# Altium schematic sheet AVR Board 4.0 Power Supply.SchDoc
size A
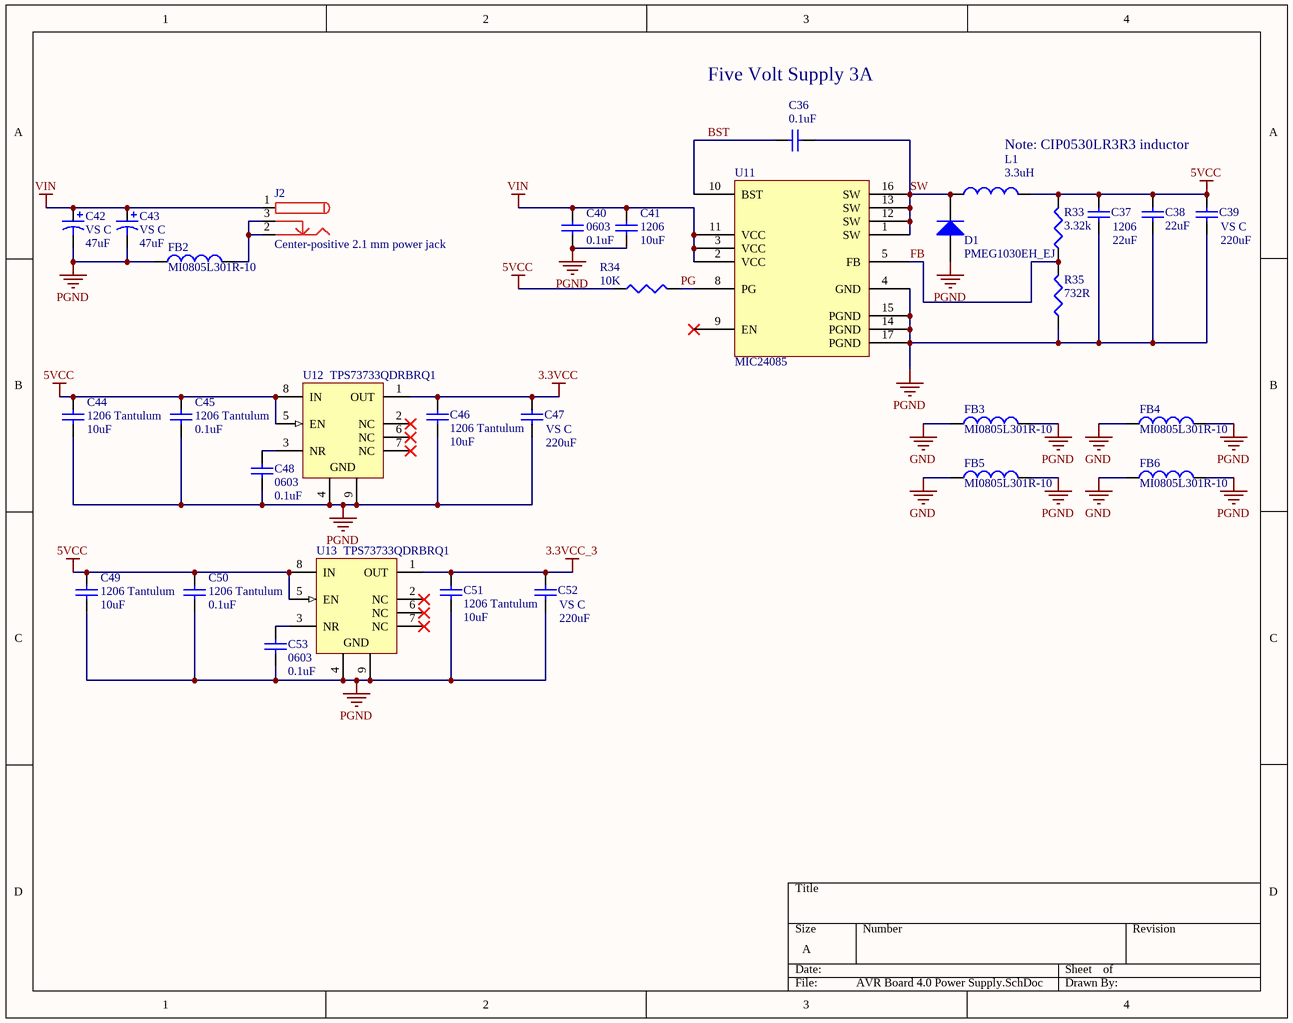
[diagram p0: AVR Board 4.0 Power Supply.SchDoc]

## Parts
C36  value 0.1uF  [1608[0603]]  (hidden comment: Cap Semi)
C37  1206  value 22uF  [C1206]
C38  value 22uF  [C1206]  (hidden comment: Cap Semi)
C39  VS C  value 220uF  [Panasonic VS C]
C40  0603  value 0.1uF  [1608[0603]]
C41  1206  value 10uF  [C1206]
C42  VS C  value 47uF  [Panasonic VS C]
C43  VS C  value 47uF  [Panasonic VS C]
C44  1206 Tantulum  value 10uF  [C1206]
C45  1206 Tantulum  value 0.1uF  [C1206]
C46  1206 Tantulum  value 10uF  [C1206]
C47  VS C  value 220uF  [Panasonic VS C]
C48  0603  value 0.1uF  [1608[0603]]
C49  1206 Tantulum  value 10uF  [C1206]
C50  1206 Tantulum  value 0.1uF  [C1206]
C51  1206 Tantulum  value 10uF  [C1206]
C52  VS C  value 220uF  [Panasonic VS C]
C53  0603  value 0.1uF  [1608[0603]]
D1  PMEG1030EH_EJ  [PMEG1030EH_EJ]
FB2  MI0805L301R-10  [SM 0805 - gap trimmed]
FB3  MI0805L301R-10  [SM 0805 - gap trimmed]
FB4  MI0805L301R-10  [SM 0805 - gap trimmed]
FB5  MI0805L301R-10  [SM 0805 - gap trimmed]
FB6  MI0805L301R-10  [SM 0805 - gap trimmed]
J2  Center-positive 2.1 mm power jack  [PJ-102AH]
L1  value 3.3uH  [CIP0530LR3R3]  (hidden comment: Inductor)
R33  value 3.32k  [J1-0603]  (hidden comment: Res3)
R34  value 10K  [J1-0603]  (hidden comment: Res3)
R35  value 732R  [J1-0603]  (hidden comment: Res3)
U11  MIC24085  [MIC24085-AYML]
U12  TPS73733QDRBRQ1  [TI-DRB8-1750X1500TP_V]
U13  TPS73733QDRBRQ1  [TI-DRB8-1750X1500TP_V]

## Nets
3.3VCC: C46.1 C47.1 U12.1(OUT)
3.3VCC_3: C51.1 C52.1 U13.1(OUT)
5VCC: C37.2 C38.1 C39.1 C44.1 C45.2 C49.1 C50.2 L1.2 R33.2 R34.1 U12.5(EN) U12.8(IN) U13.5(EN) U13.8(IN)
GND: FB3.1 FB4.1 FB5.1 FB6.1
PGND: C37.1 C38.2 C39.2 C40.1 C41.1 C42.2 C43.2 C44.2 C45.1 C46.2 C47.2 C48.1 C49.2 C50.1 C51.2 C52.2 C53.1 D1.1(A) FB2.1 FB3.2 FB4.2 FB5.2 FB6.2 R35.1 U11.4(GND) U11.14(PGND) U11.15(PGND) U11.17(PGND) U12.4(GND) U12.9(GND) U13.4(GND) U13.9(GND)
VIN: C40.2 C41.2 C42.1 C43.1 J2.1 U11.2(VCC) U11.3(VCC) U11.11(VCC)
BST: C36.2 U11.10(BST)
FB: R33.1 R35.2 U11.5(FB)
PG: R34.2 U11.8(PG)
SW: C36.1 D1.2(K) L1.1 U11.1(SW) U11.12(SW) U11.13(SW) U11.16(SW)
NetC48_2: C48.2 U12.3(NR)
NetC53_2: C53.2 U13.3(NR)
NetFB2_2: FB2.2 J2.2 J2.3

Not connected (* = marked no-connect by the designer): U11 6(NC) 7(NC) 9(EN)*; U12 2(NC)* 6(NC)* 7(NC)*; U13 2(NC)* 6(NC)* 7(NC)*

## Notes on the sheet
- Five Volt Supply 3A
- Note: CIP0530LR3R3 inductor

## Library data of the parts
C36-C41 C44-C53 = Cap Semi: Capacitor (Semiconductor SIM Model); Published: 8-Jun-2000; LatestRevisionDate: 29-May-2009; LatestRevisionNote: IPC-7351 Footprint Added.; PackageReference: C1206; Publisher: Altium Limited; PackageDescription: Chip Capacitor
C42 C43 = Cap Pol3: Polarized Capacitor (Surface Mount); Published: 8-Jun-2000; LatestRevisionDate: 29-May-2009; LatestRevisionNote: IPC-7351 Footprint Added.; PackageReference: C0805; Publisher: Altium Limited; PackageDescription: Chip Capacitor
D1 = Diode: Default Diode; Published: 8-Jun-2000; LatestRevisionDate: 17-Jul-2002; LatestRevisionNote: Re-released for DXP Platform.; PackageVersion: Sep-1996; PackageReference: SMC; Publisher: Altium Limited; PackageDescription: DO-214-AB/SMC; 2 C-Bend Leads; Body 7.9 x 5.9 mm, inc. leads (LxW); Code_JEDEC: DO-214-AB
FB2-FB6 L1 = Inductor: Code_IEC: 1005; Published: 8-Jun-2000; PackageReference: 0402-A; Publisher: Altium Limited; Code_JEITA: 0402
  FB2-FB6: LatestRevisionDate: 17-Jul-2002; LatestRevisionNote: Re-released for DXP Platform.
  L1: LatestRevisionDate: 29-May-2009; LatestRevisionNote: IPC-7351 Footprint Added.; PackageDescription: Chip Inductor
J2 = PWR2.5: Power jack; Published: 17-Dec-2003; DatasheetDocument: 09-May-2002; Publisher: Altium Limited; ComponentLink1Description: Manufacturer Link; ComponentLink1URL: http://domino.kycon.com/internet/Products.html
R33-R35 = Res3: Resistor; Published: 8-Jun-2000; LatestRevisionDate: 29-May-2009; LatestRevisionNote: IPC-7351 Footprint Added.; PackageReference: J1-0603; Publisher: Altium Limited; PackageDescription: Chip Resistor
U12 U13 = TPS73733QDRBRQ1: Single Output Automotive LDO, 1 A, Fixed 3.3 V Output, 2.2 to 5.5 V Input, with Reverse Current Protection, 8-pin SON (DRB), -40 to 125 degC, Green (RoHS & no Sb/Br); Manufacturer: Texas Instruments; Accuracy(%): 3; Fixed Output Options(V): 3.3; Iout(Max)(A): 1; Iq(Typ)(mA): 0.3; SubFamily: Single Channel LDO; Vdo(Typ)(mV): 130; Vin(Max)(V): 5.5; Vin(Min)(V): 2.2; DatasheetVersion: SBVS123; PackageVersion: 4203482-2/K; PackageReference: DRB8-1750X1500TP; PackageDescription: 8-Pin Plastic Small Outline, Body 3 x 3 mm, Pitch 0.65 mm; Supplier 1: Digi-Key; Supplier Part Number 1: 296-24157-2-ND; Supplier 2: Digi-Key; Supplier Part Number 2: 296-24157-1-ND; Supplier 3: Digi-Key; Supplier Part Number 3: 296-24157-6-ND; Supplier 4: Newark; Supplier Part Number 4: 56P3118; Supplier 5: Mouser; Supplier Part Number 5: 595-TPS73733QDRBRQ1; Eco-Plan: Green (RoHS & no Sb/Br); Rating: Automotive; Vout Adj(Max)(V): 3.3; Vout Adj(Min)(V): 3.3; Mounting Technology: Surface Mount; PartNumber: TPS73733QDRBRQ1; ComponentLink1Description: Manufacturer URL; ComponentLink1URL: http://www.ti.com/; ComponentLink2Description: Datasheet; ComponentLink2URL: http://www.ti.com/general/docs/lit/getliterature.tsp?genericPartNumber=TPS73733-Q1&fileType=pdf; ComponentLink3Description: Package Specification; ComponentLink3URL: http://www.ti.com/litv/pdf/mpds118h